# Altium schematic sheet USB-PD.SchDoc: USB-PD CHARGER
size A4; SheetNumber: 2; SheetTotal: 5; DOC_NO_SCH_DWG: #022024031001
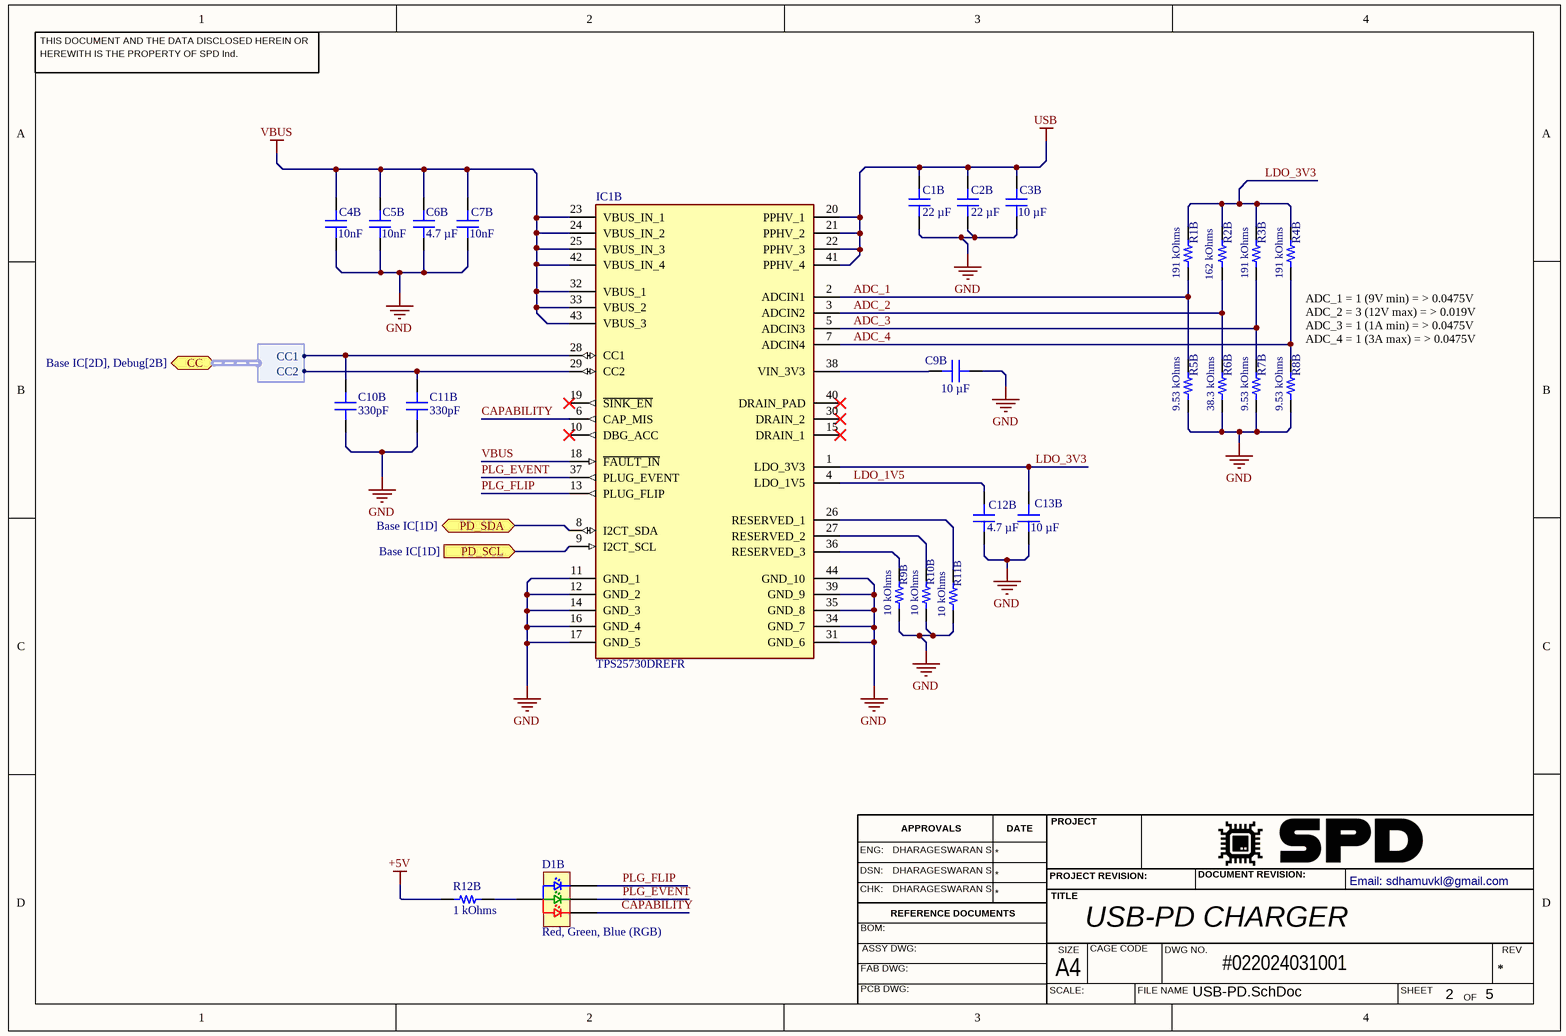
[diagram p0: USB-PD.SchDoc]

## Parts
C1B  22 µF  [CAP 0603_1608]
C2B  22 µF  [CAP 0603_1608]
C3B  10 µF  [CAP 0603_1608]
C4B  10nF  [CAP 0402_1005]
C5B  10nF  [CAP 0402_1005]
C6B  4.7 µF  [CAP 0402_1005]
C7B  10nF  [CAP 0402_1005]
C9B  10 µF  [CAP 0603_1608]
C10B  330pF  [CAP 0402_1005]
C11B  330pF  [CAP 0402_1005]
C12B  4.7 µF  [CAP 0402_1005]
C13B  10 µF  [CAP 0603_1608]
D1B  Red, Green, Blue (RGB)  [Harvatek B38G3RGB-10D0003H2U1930]
IC1B  TPS25730DREFR  [TPS25730DREFR]
R1B  191 kOhms  [RES 0402_1005]
R2B  162 kOhms  [RES 0402_1005]
R3B  191 kOhms  [RES 0402_1005]
R4B  191 kOhms  [RES 0402_1005]
R5B  9.53 kOhms  [RES 0402_1005]
R6B  38.3 kOhms  [RES 0402_1005]
R7B  9.53 kOhms  [RES 0402_1005]
R8B  9.53 kOhms  [RES 0402_1005]
R9B  10 kOhms  [RES 0402_1005]
R10B  10 kOhms  [RES 0402_1005]
R11B  10 kOhms  [RES 0402_1005]
R12B  1 kOhms  [RES 0603_1608]

## Ports
CC (bidir, harness CC, see Base IC[2D], Debug[2B]), PD_SCL (in, see Base IC[1D]), PD_SDA (bidir, see Base IC[1D])

## Harnesses
CC: CC1, CC2

## Nets
+5V: R12B.1
GND: C1B.1 C2B.1 C3B.2 C4B.1 C5B.1 C6B.1 C7B.1 C9B.1 C10B.1 C11B.1 C12B.1 C13B.1 IC1B.11(GND_1) IC1B.12(GND_2) IC1B.14(GND_3) IC1B.16(GND_4) IC1B.17(GND_5) IC1B.31(GND_6) IC1B.34(GND_7) IC1B.35(GND_8) IC1B.39(GND_9) IC1B.44(GND_10) R5B.1 R6B.1 R7B.1 R8B.1 R9B.2 R10B.2 R11B.2
USB: C1B.2 C2B.2 C3B.1 IC1B.20(PPHV_1) IC1B.21(PPHV_2) IC1B.22(PPHV_3) IC1B.41(PPHV_4)
VBUS: C4B.2 C5B.2 C6B.2 C7B.2 IC1B.18(~{FAULT_IN}) IC1B.23(VBUS_IN_1) IC1B.24(VBUS_IN_2) IC1B.25(VBUS_IN_3) IC1B.32(VBUS_1) IC1B.33(VBUS_2) IC1B.42(VBUS_IN_4) IC1B.43(VBUS_3)
ADC_1: IC1B.2(ADCIN1) R1B.1 R5B.2
ADC_2: IC1B.3(ADCIN2) R2B.1 R6B.2
ADC_3: IC1B.5(ADCIN3) R3B.1 R7B.2
ADC_4: IC1B.7(ADCIN4) R4B.1 R8B.2
CAPABILITY: D1B.4(RED) IC1B.6(CAP_MIS)
LDO_1V5: C12B.2 IC1B.4(LDO_1V5)
LDO_3V3: C13B.2 IC1B.1(LDO_3V3) R1B.2 R2B.2 R3B.2 R4B.2
PD_SCL: IC1B.9(I2CT_SCL) ; port PD_SCL
PD_SDA: IC1B.8(I2CT_SDA) ; port PD_SDA
PLG_EVENT: D1B.1(GREEN) IC1B.37(PLUG_EVENT)
PLG_FLIP: D1B.2(BLUE) IC1B.13(PLUG_FLIP)
NetC9B_2: C9B.2 IC1B.38(VIN_3V3)
NetC10B_2: C10B.2 IC1B.28(CC1) ; port CC.CC1
NetC11B_2: C11B.2 IC1B.29(CC2) ; port CC.CC2
NetD1B_3: D1B.3(ANODE) R12B.2
NetIC1B_26: IC1B.26(RESERVED_1) R11B.1
NetIC1B_27: IC1B.27(RESERVED_2) R10B.1
NetIC1B_36: IC1B.36(RESERVED_3) R9B.1

Not connected (* = marked no-connect by the designer): IC1B 10(DBG_ACC)* 15(DRAIN_1)* 19(~{SINK_EN})* 30(DRAIN_2)* 40(DRAIN_PAD)*

## Notes on the sheet
- ADC_1 = 1 (9V min) = > 0.0475V
  ADC_2 = 3 (12V max) = > 0.019V
  ADC_3 = 1 (1A min) = > 0.0475V
  ADC_4 = 1 (3A max) = > 0.0475V
- THIS DOCUMENT AND THE DATA DISCLOSED HEREIN OR
- HEREWITH IS THE PROPERTY OF SPD Ind.
- ENG:
- DHARAGESWARAN S
- APPROVALS
- DATE
- PROJECT
- DSN:
- CHK:
- REFERENCE DOCUMENTS
- PROJECT REVISION:
- TITLE
- DOCUMENT REVISION:
- Email: sdhamuvkl@gmail.com <https://github.com/DhamuVkl>
- BOM:
- FAB DWG:
- PCB DWG:
- ASSY DWG:
- SCALE:
- A4
- SIZE
- CAGE CODE
- FILE NAME
- DWG NO.
- SHEET
- REV
- OF

## Library data of the parts
C1B C2B = CL10A226MO7JZNC: CAP CER 22UF 16V X5R 0603; Manufacturer: Samsung Electro-Mechanics; id: 3280; Tolerance: ±20%; Part Number: CL10A226MO7JZNC; Value: 22 µF; Temperature Coefficient: X5R; Supplier Part Number 1: 1276-7076-1-ND; ComponentLink2Description: DigiKey Link; ComponentLink1URL: http://www.samsungsem.com/kr/support/product-search/mlcc/CL10A226MO7JZNC.jsp; PartId: 15245; Supplier 1: DigiKey; Series: CL; LastUpdated: 2023-01-03T20:07:09.957; Part Status: Active; Capacitance: 22 µF; Device Package: 0603 (1608 Metric); Thickness (Max): 0.031" (0.80mm); Voltage - Rated: 16V; Minimum Order: 1; Packaging: TapeAndReel; Applications: General Purpose; Package / Case: 0603 (1608 Metric); ComponentLink1Description: Datasheet; Price: 0.14; ComponentLink2URL: https://www.digikey.com/en/products/detail/samsung-electro-mechanics/CL10A226MO7JZNC/7320581; Lifecycle Status: Active; Operating Temperature: -55°C ~ 85°C; Size / Dimension: 0.063" L x 0.031" W (1.60mm x 0.80mm); Mounting Type: Surface Mount, MLCC
C3B C9B C13B = GRM188R61E106KA73D: CAP CER 10UF 25V X5R 0603; Manufacturer: Murata Electronics; id: 2462; Tolerance: ±10%; Part Number: GRM188R61E106KA73D; Value: 10 µF; Temperature Coefficient: X5R; Supplier Part Number 1: 490-18214-1-ND; ComponentLink2Description: DigiKey Link; ComponentLink1URL: https://search.murata.co.jp/Ceramy/image/img/A01X/G101/ENG/GRM188R61E106KA73-01.pdf; PartId: 12669; Supplier 1: DigiKey; Series: GRM; LastUpdated: 2023-01-03T20:07:18.763; Part Status: Active; Capacitance: 10 µF; Device Package: 0603 (1608 Metric); Thickness (Max): 0.039" (1.00mm); Voltage - Rated: 25V; Minimum Order: 1; Packaging: TapeAndReel; Applications: General Purpose; Package / Case: 0603 (1608 Metric); ComponentLink1Description: Datasheet; Price: 0.04; ComponentLink2URL: https://www.digikey.com/en/products/detail/murata-electronics/GRM188R61E106KA73D/9867922; Lifecycle Status: Active; Operating Temperature: -55°C ~ 85°C; Size / Dimension: 0.063" L x 0.031" W (1.60mm x 0.80mm); Mounting Type: Surface Mount, MLCC
C4B C5B C7B = C0402C103J5RECAUTO: CAP CER 0402 10NF 50V X7R 5%; Manufacturer: KEMET; id: 3927; Value: 10000 pF; Part Number: C0402C103J5RECAUTO; Temperature Coefficient: X7R; Supplier Part Number 1: 399-C0402C103J5RECAUTOCT-ND; ComponentLink2Description: DigiKey Link; ComponentLink1URL: https://api.kemet.com/component-edge/download/datasheet/C0402C103J5RECAUTO.pdf; PartId: 33153; Tolerance: ±5%; Supplier 1: DigiKey; Series: ESD SMD Auto X7R; LastUpdated: 2023-01-03T20:03:32.240; Part Status: Active; Capacitance: 10000 pF; Device Package: 0402 (1005 Metric); Ratings: AEC-Q200; Thickness (Max): 0.022" (0.55mm); Voltage - Rated: 50V; Minimum Order: 1; Packaging: TapeAndReel; Applications: Automotive, ESD Protection; Package / Case: 0402 (1005 Metric); ComponentLink1Description: Datasheet; Price: 0.02; ComponentLink2URL: https://www.digikey.com/en/products/detail/kemet/C0402C103J5RECAUTO/8646448; Lifecycle Status: Active; Operating Temperature: -55°C ~ 125°C; Size / Dimension: 0.039" L x 0.020" W (1.00mm x 0.50mm); Mounting Type: Surface Mount, MLCC
C6B C12B = GMC04X5R475K10NT: CAP0402 X5R 4.7UF 10% 10V; Manufacturer: Cal-Chip Electronics, Inc.; id: 6422; Part Number: GMC04X5R475K10NT; Value: 4.7 µF; Temperature Coefficient: X5R; Supplier Part Number 1: 4713-GMC04X5R475K10NTCT-ND; ComponentLink2Description: DigiKey Link; ComponentLink1URL: https://88ce57.p3cdn1.secureserver.net/wp-content/uploads/2023/01/gmc_series-2.pdf; PartId: 49814; Tolerance: ±10%; Supplier 1: DigiKey; Series: GMC; LastUpdated: 2023-04-21T19:03:30.743; Part Status: Active; Capacitance: 4.7 µF; Device Package: 0402 (1005 Metric); Thickness (Max): 0.028" (0.70mm); Voltage - Rated: 10V; Minimum Order: 1; Packaging: TapeAndReel; Applications: General Purpose; Package / Case: 0402 (1005 Metric); ComponentLink1Description: Datasheet; Price: 0.01; ComponentLink2URL: https://www.digikey.com/en/products/detail/cal-chip-electronics-inc/GMC04X5R475K10NT/18151135; Lifecycle Status: Active; Operating Temperature: -55°C ~ 85°C; Size / Dimension: 0.039" L x 0.020" W (1.00mm x 0.50mm); Mounting Type: Surface Mount, MLCC
C10B C11B = 0402YA331JAT2A: CAP CER 330PF 16V NP0 0402; Manufacturer: AVX Corporation; id: 3428; Temperature Coefficient: C0G, NP0; Tolerance: ±5%; Part Number: 0402YA331JAT2A; Value: 330pF; Supplier Part Number 1: 478-0402YA331JAT2ACT-ND; ComponentLink2Description: DigiKey Link; ComponentLink1URL: http://datasheets.avx.com/C0GNP0-Dielectric.pdf; PartId: 27100; Supplier 1: DigiKey; Series: -; LastUpdated: 2022-02-08T12:26:34.560; Part Status: Active; Capacitance: 330pF; Device Package: 0402 (1005 Metric); Voltage - Rated: 16V; Minimum Order: 1; Packaging: TapeAndReel; Applications: General Purpose; Package / Case: 0402 (1005 Metric); ComponentLink1Description: Datasheet; Price: 0.01; ComponentLink2URL: http://digikey.com/product-detail/en/avx-corporation/0402YA331JAT2A/478-0402YA331JAT2ACT-ND/11570207; Lifecycle Status: Active; Operating Temperature: -55°C ~ 125°C; Mounting Type: Surface Mount, MLCC
D1B = B38G3RGB-10D0003H2U1930: LED RGB MIXED WHITE ( 1.6(L)X1.6; Manufacturer: Harvatek Corporation; id: 1399; Lens Style: Rectangle with Flat Top; Lens Size: 1.60mm x 1.10mm; Configuration: Common Anode; Voltage - Forward (Vf) (Typ): 2V Red, 3V Green, 3V Blue; Current - Test: 10mA Red, 10mA Green, 10mA Blue; Millicandela Rating: 630mcd Red, 630mcd Green, 630mcd Blue; Part Number: B38G3RGB-10D0003H2U1930; Supplier Part Number 1: 3147-B38G3RGB-10D0003H2U1930CT-ND; Supplier Device Package: 0606; ComponentLink1Description: Datasheet; Color: Red, Green, Blue (RGB); ComponentLink2URL: https://www.digikey.com/en/products/detail/harvatek-corporation/B38G3RGB-10D0003H2U1930/13588733; ComponentLink1URL: https://media.digikey.com/pdf/Data%20Sheets/Harvatek%20PDFs/B38G3RGB-10D0003H2U1930%20%20V1.9.pdf; Supplier 1: DigiKey; Series: -; Height (Max): 0.50mm; Part Status: Active; ComponentLink2Description: DigiKey Link; Packaging: TapeAndReel; Minimum Order: 1; PartId: 1416; Lifecycle Status: Active; LastUpdated: 2023-10-31T16:54:14.060; Value: Red, Green, Blue (RGB); Size / Dimension: 1.60mm L x 1.60mm W; Mounting Type: Surface Mount; Price: 0.11
IC1B = TPS25730DREFR: USB PD Controller; Manufacturer_Name: Texas Instruments; Datasheet Link: https://www.ti.com/lit/ds/symlink/tps25730.pdf?ts=1707773923998&ref_url=https%253A%252F%252Fwww.mouser.at%252F; Height: 0.8mm; Manufacturer_Part_Number: TPS25730DREFR; Mouser Part Number: 595-TPS25730DREFR; Mouser Price/Stock: https://www.mouser.co.uk/ProductDetail/Texas-Instruments/TPS25730DREFR?qs=Z%252BL2brAPG1IvmkUK7DRnBA%3D%3D; Supplier 1: Mouser; Supplier Part Number 1: 595-TPS25730DREFR
R1B R3B R4B = AC0402FR-07191KL: RES SMD 191K OHM 1% 1/16W 0402; Manufacturer: Yageo; id: 11854; Temperature Coefficient: ±100ppm/°C; Power (Watts): 0.063W, 1/16W; Part Number: AC0402FR-07191KL; Height - Seated (Max): 0.015" (0.37mm); Supplier Part Number 1: 13-AC0402FR-07191KLCT-ND; Supplier Device Package: 0402; ComponentLink1Description: Datasheet; ComponentLink2URL: https://www.digikey.com/en/products/detail/yageo/AC0402FR-07191KL/5895119; Features: Automotive AEC-Q200, Moisture Resistant; ComponentLink1URL: https://www.yageo.com/upload/media/product/productsearch/datasheet/rchip/PYu-AC_51_RoHS_L_8.pdf; Composition: Thick Film; Tolerance: ±1%; Supplier 1: DigiKey; Series: AC; Part Status: Active; ComponentLink2Description: DigiKey Link; Device Package: 0402 (1005 Metric); Packaging: CutTape; Ratings: AEC-Q200; Minimum Order: 1; Package / Case: 0402 (1005 Metric); PartId: 60441; Lifecycle Status: Active; LastUpdated: 2023-01-02T20:20:21.097; Operating Temperature: -55°C ~ 155°C; Number Of Terminations: 2; Value: 191 kOhms; Size / Dimension: 0.039" L x 0.020" W (1.00mm x 0.50mm); Price: 0.01; Resistance: 191 kOhms
R2B = CR0402-FX-1623GLF: RES SMD 162K OHM 1% 1/16W 0402; Manufacturer: Bourns Inc.; id: 4470; Temperature Coefficient: ±100ppm/°C; Power (Watts): 0.063W, 1/16W; Part Number: CR0402-FX-1623GLF; Height - Seated (Max): 0.016" (0.40mm); Supplier Part Number 1: CR0402-FX-1623GLFCT-ND; Supplier Device Package: 0402; ComponentLink1Description: Datasheet; ComponentLink2URL: https://www.digikey.com/en/products/detail/bourns-inc/CR0402-FX-1623GLF/3783178; ComponentLink1URL: https://www.bourns.com/docs/Product-Datasheets/CR0402.pdf; Composition: Thick Film; Tolerance: ±1%; Supplier 1: DigiKey; Series: CR0402; Part Status: Active; ComponentLink2Description: DigiKey Link; Device Package: 0402 (1005 Metric); Packaging: CutTape; Minimum Order: 1; Package / Case: 0402 (1005 Metric); PartId: 11053; Lifecycle Status: Active; LastUpdated: 2023-01-02T20:21:14.190; Operating Temperature: -55°C ~ 155°C; Number Of Terminations: 2; Value: 162 kOhms; Size / Dimension: 0.039" L x 0.020" W (1.00mm x 0.50mm); Price: 0.01; Resistance: 162 kOhms
R5B R7B R8B = CRCW04029K53FKEDC: RES 9.53K OHM 1% 1/16W 0402; Manufacturer: Vishay Dale; id: 12430; Temperature Coefficient: ±100ppm/°C; Power (Watts): 0.063W, 1/16W; Part Number: CRCW04029K53FKEDC; Height - Seated (Max): 0.014" (0.35mm); Supplier Part Number 1: 541-5131-1-ND; Supplier Device Package: 0402; ComponentLink1Description: Datasheet; ComponentLink2URL: https://www.digikey.com/en/products/detail/vishay-dale/CRCW04029K53FKEDC/7925987; ComponentLink1URL: https://www.vishay.com/docs/28773/crcwce3.pdf; Composition: Thick Film; Tolerance: ±1%; Supplier 1: DigiKey; Series: CRCW-C; Part Status: Active; ComponentLink2Description: DigiKey Link; Device Package: 0402 (1005 Metric); Packaging: CutTape; Minimum Order: 1; Package / Case: 0402 (1005 Metric); PartId: 66777; Lifecycle Status: Active; LastUpdated: 2023-01-02T20:20:02.490; Operating Temperature: -55°C ~ 155°C; Number Of Terminations: 2; Value: 9.53 kOhms; Size / Dimension: 0.039" L x 0.020" W (1.00mm x 0.50mm); Price: 0.10; Resistance: 9.53 kOhms
R6B = AC0402FR-0738K3L: RES SMD 38.3K OHM 1% 1/16W 0402; Manufacturer: Yageo; id: 12409; Temperature Coefficient: ±100ppm/°C; Power (Watts): 0.063W, 1/16W; Part Number: AC0402FR-0738K3L; Height - Seated (Max): 0.015" (0.37mm); Supplier Part Number 1: 13-AC0402FR-0738K3LCT-ND; Supplier Device Package: 0402; ComponentLink1Description: Datasheet; ComponentLink2URL: https://www.digikey.com/en/products/detail/yageo/AC0402FR-0738K3L/5895312; Features: Automotive AEC-Q200, Moisture Resistant; ComponentLink1URL: https://www.yageo.com/upload/media/product/productsearch/datasheet/rchip/PYu-AC_51_RoHS_L_8.pdf; Composition: Thick Film; Tolerance: ±1%; Supplier 1: DigiKey; Series: AC; Part Status: Active; ComponentLink2Description: DigiKey Link; Device Package: 0402 (1005 Metric); Packaging: CutTape; Ratings: AEC-Q200; Minimum Order: 1; Package / Case: 0402 (1005 Metric); PartId: 65263; Lifecycle Status: Active; LastUpdated: 2023-01-02T20:20:08.577; Operating Temperature: -55°C ~ 155°C; Number Of Terminations: 2; Value: 38.3 kOhms; Size / Dimension: 0.039" L x 0.020" W (1.00mm x 0.50mm); Price: 0.01; Resistance: 38.3 kOhms
R9B R10B R11B = AC0402FR-1310KL: RES 10K OHM 1% 1/16W 0402; Manufacturer: Yageo; id: 13132; Temperature Coefficient: ±100ppm/°C; Power (Watts): 0.063W, 1/16W; Part Number: AC0402FR-1310KL; Height - Seated (Max): 0.015" (0.37mm); Supplier Part Number 1: 13-AC0402FR-1310KLCT-ND; Supplier Device Package: 0402; ComponentLink1Description: Datasheet; ComponentLink2URL: https://www.digikey.com/en/products/detail/yageo/AC0402FR-1310KL/12756397; Features: Automotive AEC-Q200, Moisture Resistant; ComponentLink1URL: https://www.yageo.com/upload/media/product/productsearch/datasheet/rchip/PYu-AC_51_RoHS_L_8.pdf; Composition: Thick Film; Tolerance: ±1%; Supplier 1: DigiKey; Series: AC; Part Status: Active; ComponentLink2Description: DigiKey Link; Device Package: 0402 (1005 Metric); Packaging: CutTape; Ratings: AEC-Q200; Minimum Order: 1; Package / Case: 0402 (1005 Metric); PartId: 69220; Lifecycle Status: Active; LastUpdated: 2023-01-02T20:19:54.633; Operating Temperature: -55°C ~ 155°C; Number Of Terminations: 2; Value: 10 kOhms; Size / Dimension: 0.039" L x 0.020" W (1.00mm x 0.50mm); Price: 0.01; Resistance: 10 kOhms
R12B = RMCF0603JT1K00: RES 1K OHM 5% 1/10W 0603; Manufacturer: Stackpole Electronics Inc; id: 454; Temperature Coefficient: ±200ppm/°C; Power (Watts): 0.1W, 1/10W; Part Number: RMCF0603JT1K00; Height - Seated (Max): 0.022" (0.55mm); Supplier Part Number 1: RMCF0603JT1K00CT-ND; Supplier Device Package: 0603; ComponentLink1Description: Datasheet; ComponentLink2URL: https://www.digikey.com/en/products/detail/stackpole-electronics-inc/RMCF0603JT1K00/1758057; Features: Automotive AEC-Q200; ComponentLink1URL: https://www.seielect.com/catalog/sei-rmcf_rmcp.pdf; Composition: Thick Film; Tolerance: ±5%; Supplier 1: DigiKey; Series: RMCF; Part Status: Active; ComponentLink2Description: DigiKey Link; Device Package: 0603 (1608 Metric); Packaging: CutTape; Ratings: AEC-Q200; Minimum Order: 1; Package / Case: 0603 (1608 Metric); PartId: 5824; Lifecycle Status: Active; LastUpdated: 2023-01-02T20:30:23.167; Operating Temperature: -55°C ~ 155°C; Number Of Terminations: 2; Value: 1 kOhms; Size / Dimension: 0.061" L x 0.031" W (1.55mm x 0.80mm); Price: 0.01; Resistance: 1 kOhms